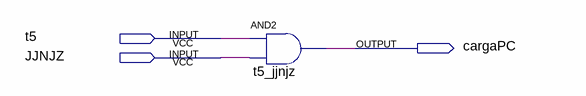
[diagram p0: schematic sheet]
// Quartus schematic carga_pc.bdf as structural Verilog: 1 symbols, 3 pins
module carga_pc (
  input  t5,
  input  JJNJZ,
  output cargaPC
);

  and t5_jjnjz (cargaPC, t5, JJNJZ);
endmodule
